# EAGLE design board_0.10v (EAGLE 7.7.0)
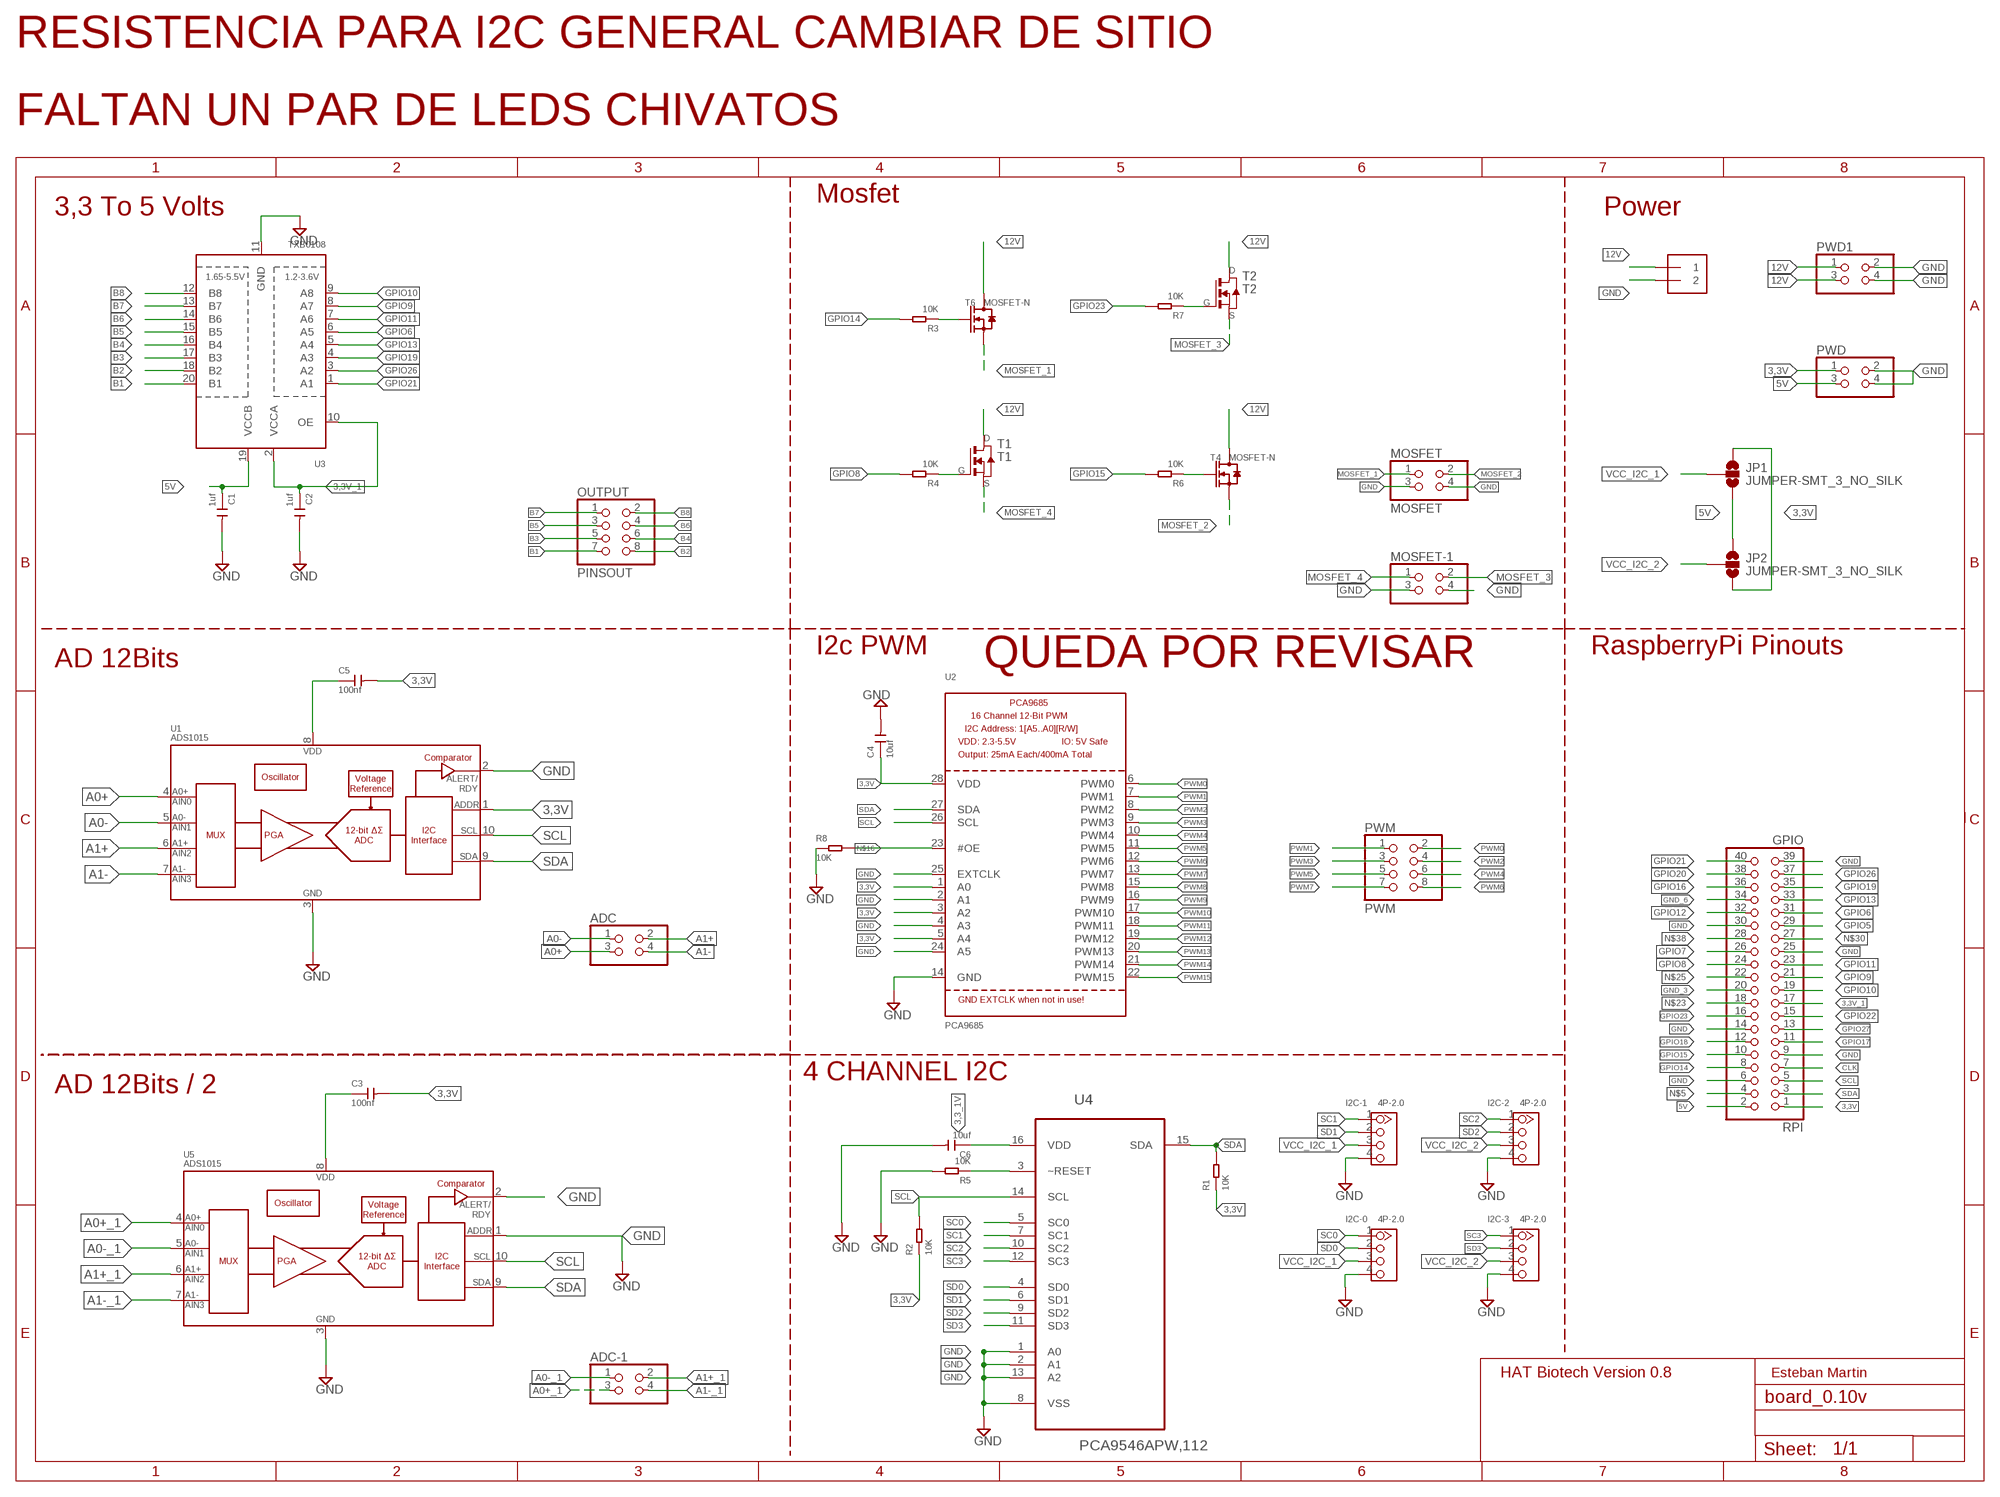
[diagram p0: schematic, sheet 1, part 1 of 2]
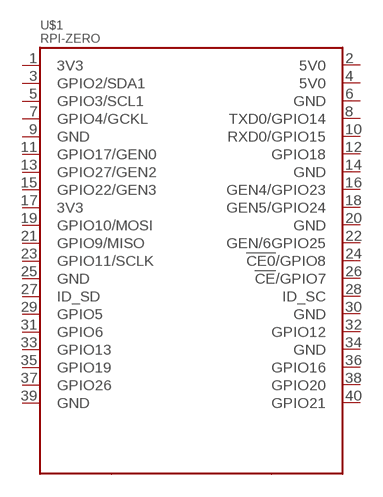
[diagram p1: schematic, sheet 1, part 2 of 2]

## Parts
ADC  PINHD-2X2  [2X02]
ADC-1  PINHD-2X2  [2X02]
C1  1uf  CERAMIC-1UF-25V-10%-X7R(0805)  [C0805]
C2  1uf  CERAMIC-1UF-25V-10%-X7R(0805)  [C0805]
C3  100nf  CERAMIC-100NF-50V-10%-X7R(0805)  [C0805]
C4  10uf  CERAMIC-1UF-25V-10%-X7R(0805)  [C0805]
C5  100nf  CERAMIC-100NF-50V-10%-X7R(0805)  [C0805]
C6  10uf  CERAMIC-1UF-25V-10%-X7R(0805)  [C0805]
I2C-0  4P-2.0  GROVE-CONNECTOR-DIP(4P-2.0)  [HW4-2.0]
I2C-1  4P-2.0  GROVE-CONNECTOR-DIP(4P-2.0)  [HW4-2.0]
I2C-2  4P-2.0  GROVE-CONNECTOR-DIP(4P-2.0)  [HW4-2.0]
I2C-3  4P-2.0  GROVE-CONNECTOR-DIP(4P-2.0)  [HW4-2.0]
INPUT  1X2-3.5MM  [1X2-3.5MM]
JP1  JUMPER-SMT_3_NO_SILK  [SMT-JUMPER_3_NO_SILK]
JP2  JUMPER-SMT_3_NO_SILK  [SMT-JUMPER_3_NO_SILK]
MOSFET  MOSFET  PINHD-2X2  [2X02]
MOSFET-1  PINHD-2X2  [2X02]
OUTPUT  PINSOUT  PINHD-2X4  [2X04]
PWD  PINHD-2X2  [2X02]
PWD1  PINHD-2X2  [2X02]
PWM  PWM  PINHD-2X4  [2X04]
R1  10K  SMD-RES-10K-1%-1/8W(0805)  [R0805]
R2  10K  SMD-RES-10K-1%-1/8W(0805)  [R0805]
R3  10K  SMD-RES-10K-1%-1/8W(0805)  [R0805]
R4  10K  SMD-RES-10K-1%-1/8W(0805)  [R0805]
R5  10K  SMD-RES-10K-1%-1/8W(0805)  [R0805]
R6  10K  SMD-RES-10K-1%-1/8W(0805)  [R0805]
R7  10K  SMD-RES-10K-1%-1/8W(0805)  [R0805]
R8  10K  SMD-RES-10K-1%-1/8W(0805)  [R0805]
RPI  GPIO  PINHD-2X20  [2X20]
T1  T1  NMOSFETTO252  [TO252]
T2  T2  NMOSFETTO252  [TO252]
T4  MOSFET-N  [SOT-23]
T6  MOSFET-N  [SOT-23]
U1  ADS1015  [MSOP10]
U2  PCA9685  [TSSOP28]
U3  TXB0108  TXB0108PWR  [TSSOP20]
U4  PCA9546APW,112  [SOP65P640X110-16N]
U5  ADS1015  [MSOP10]
U$1  RPI-ZERO  [RASPBERRYPI_BASTELSTUBE_V13_RASPI_BOARD_B+_FULL]

## Nets
3,3_1V: C6.1 U4.16(VDD)
3,3V: C3.2 C4.1 C5.2 JP1.1 JP2.3 PWD.1 R1.1 R2.1 RPI.1 U1.1(ADDR) U2.1(A0) U2.3(A2) U2.5(A4) U2.28(VDD)
3,3V_1: C2.1 RPI.17 U3.2(VCCA) U3.10(OE)
5V: C1.1 JP1.3 JP2.1 PWD.3 RPI.2 U3.19(VCCB)
12V: INPUT.1 PWD1.1 PWD1.3 T1.3(D) T2.3(D) T4.3(D) T6.3(D)
A0+: ADC.3 U1.4(AIN0)
A0+_1: ADC-1.3 U5.4(AIN0)
A0-: ADC.1 U1.5(AIN1)
A0-_1: ADC-1.1 U5.5(AIN1)
A1+: ADC.2 U1.6(AIN2)
A1+_1: ADC-1.2 U5.6(AIN2)
A1-: ADC.4 U1.7(AIN3)
A1-_1: ADC-1.4 U5.7(AIN3)
B1: OUTPUT.7 U3.20(B1)
B2: OUTPUT.8 U3.18(B2)
B3: OUTPUT.5 U3.17(B3)
B4: OUTPUT.6 U3.16(B4)
B5: OUTPUT.3 U3.15(B5)
B6: OUTPUT.4 U3.14(B6)
B7: OUTPUT.1 U3.13(B7)
B8: OUTPUT.2 U3.12(B8)
CLK: RPI.7
GND: C1.2 C2.2 C4.2 C6.2 I2C-0.4 I2C-1.4 I2C-2.4 I2C-3.4 INPUT.2 MOSFET-1.3 MOSFET-1.4 MOSFET.3 MOSFET.4 PWD1.2 PWD1.4 PWD.2 PWD.4 R5.2 R8.1 RPI.6 RPI.9 RPI.14 RPI.25 RPI.30 RPI.39 U1.2(ALERT/RDY) U1.3(VSS) U2.2(A1) U2.4(A3) U2.14(GND) U2.24(A5) U2.25(EXTCLK) U3.11(GND) U4.1(A0) U4.2(A1) U4.8(VSS) U4.13(A2) U5.1(ADDR) U5.2(ALERT/RDY) U5.3(VSS)
GND_3: RPI.20
GND_6: RPI.34
GPIO5: RPI.29
GPIO6: RPI.31 U3.6(A5)
GPIO7: RPI.26
GPIO8: R4.2 RPI.24
GPIO9: RPI.21 U3.8(A7)
GPIO10: RPI.19 U3.9(A8)
GPIO11: RPI.23 U3.7(A6)
GPIO12: RPI.32
GPIO13: RPI.33 U3.5(A4)
GPIO14: R3.2 RPI.8
GPIO15: R6.2 RPI.10
GPIO16: RPI.36
GPIO17: RPI.11
GPIO18: RPI.12
GPIO19: RPI.35 U3.4(A3)
GPIO20: RPI.38
GPIO21: RPI.40 U3.1(A1)
GPIO22: RPI.15
GPIO23: R7.2 RPI.16
GPIO26: RPI.37 U3.3(A2)
GPIO27: RPI.13
MOSFET_1: MOSFET.1 T6.2(S)
MOSFET_2: MOSFET.2 T4.2(S)
MOSFET_3: MOSFET-1.2 T2.2(S)
MOSFET_4: MOSFET-1.1 T1.2(S)
N$5: RPI.4
N$6: R3.1 T6.1(G)
N$7: R5.1 U4.3(~RESET)
N$8: C3.1 U5.8(VDD)
N$9: R4.1 T1.1(G)
N$10: R6.1 T4.1(G)
N$11: R7.1 T2.1(G)
N$13: C5.1 U1.8(VDD)
N$16: R8.2 U2.23(#OE)
N$23: RPI.18
N$25: RPI.22
N$30: RPI.27
N$38: RPI.28
PWM0: PWM.2 U2.6(PWM0)
PWM1: PWM.1 U2.7(PWM1)
PWM2: PWM.4 U2.8(PWM2)
PWM3: PWM.3 U2.9(PWM3)
PWM4: PWM.6 U2.10(PWM4)
PWM5: PWM.5 U2.11(PWM5)
PWM6: PWM.8 U2.12(PWM6)
PWM7: PWM.7 U2.13(PWM7)
PWM8: U2.15(PWM8)
PWM9: U2.16(PWM9)
PWM10: U2.17(PWM10)
PWM11: U2.18(PWM11)
PWM12: U2.19(PWM12)
PWM13: U2.20(PWM13)
PWM14: U2.21(PWM14)
PWM15: U2.22(PWM15)
SC0: I2C-0.1 U4.5(SC0)
SC1: I2C-1.1 U4.7(SC1)
SC2: I2C-2.1 U4.10(SC2)
SC3: I2C-3.1 U4.12(SC3)
SCL: R2.2 RPI.5 U1.10(SCL) U2.26(SCL) U4.14(SCL) U5.10(SCL)
SD0: I2C-0.2 U4.4(SD0)
SD1: I2C-1.2 U4.6(SD1)
SD2: I2C-2.2 U4.9(SD2)
SD3: I2C-3.2 U4.11(SD3)
SDA: R1.2 RPI.3 U1.9(SDA) U2.27(SDA) U4.15(SDA) U5.9(SDA)
VCC_I2C_1: I2C-0.3 I2C-1.3 JP1.2
VCC_I2C_2: I2C-2.3 I2C-3.3 JP2.2
Unconnected: U$1.1(3V3) U$1.2(5V0) U$1.3(GPIO2/SDA1) U$1.4(5V0) U$1.5(GPIO3/SCL1) U$1.6(GND) U$1.7(GPIO4/GCKL) U$1.8(TXD0/GPIO14) U$1.9(GND) U$1.10(RXD0/GPIO15) U$1.11(GPIO17/GEN0) U$1.12(GPIO18) U$1.13(GPIO27/GEN2) U$1.14(GND) U$1.15(GPIO22/GEN3) U$1.16(GEN4/GPIO23) U$1.17(3V3) U$1.18(GEN5/GPIO24) U$1.19(GPIO10/MOSI) U$1.20(GND) U$1.21(GPIO9/MISO) U$1.22(GEN/6GPIO25) U$1.23(GPIO11/SCLK) U$1.24(!CE0!/GPIO8) U$1.25(GND) U$1.26(!CE!/GPIO7) U$1.27(ID_SD) U$1.28(ID_SC) U$1.29(GPIO5) U$1.30(GND) U$1.31(GPIO6) U$1.32(GPIO12) U$1.33(GPIO13) U$1.34(GND) U$1.35(GPIO19) U$1.36(GPIO16) U$1.37(GPIO26) U$1.38(GPIO20) U$1.39(GND) U$1.40(GPIO21)

## Notes on the sheet
- RESISTENCIA PARA I2C GENERAL CAMBIAR DE SITIO
- FALTAN UN PAR DE LEDS CHIVATOS
- Mosfet
- 3,3 To 5 Volts | Power
- I2c PWM | RaspberryPi Pinouts
- AD 12Bits | QUEDA POR REVISAR
- 4 CHANNEL I2C
- AD 12Bits / 2
- HAT Biotech Version 0.8 | Esteban Martin

## Library data of the parts
ADC ADC-1 MOSFET MOSFET-1 PWD PWD1 = pinhead:PINHD-2X2: PIN HEADER
C1 C2 = Seeed-OPL-Capacitor:CERAMIC-1UF-25V-10%-X7R(0805): 302010179; MPN: CC0805KKX7R8BB105
C3 C5 = Seeed-OPL-Capacitor:CERAMIC-100NF-50V-10%-X7R(0805): 302010165; MPN: CC0805KRX7R9BB104
C4 C6 = Seeed-OPL-Capacitor:CERAMIC-1UF-25V-10%-X7R(0805): 302010179; MPN: CC0805KKX7R8BB105; VALUE: 1uf
I2C-0 I2C-1-I2C-3 = Seeed-OPL-Connector:GROVE-CONNECTOR-DIP(4P-2.0): 320110033
INPUT = adafruit:1X2: 3.5mm Terminal block http://www.ladyada.net/library/pcb/eaglelibrary.html
JP1 JP2 = SparkFun-Jumpers:JUMPER-SMT_3_NO: Normally open jumper This jumper has three pads in close proximity to each other. Apply solder to close the connection(s).
OUTPUT PWM = adafruit:PINHD-2X4: PIN HEADER
R1-R8 = Seeed-OPL-Resistor:SMD-RES-10K-1%-1/8W(0805): 301010361; MPN: RC0805FR-0710KL
RPI = adafruit:PINHD-2X20: PIN HEADER
T1 T2 = fab_2:NMOSFET: MOS FET
T4 T6 = Seeed-OPL-Transistor:MOSFET-N
U1 U5 = SparkFun-IC-Conversion:ADS1015: ADS1015 12-BIT ADC 12-Bit Del-Sig ADC Four single-ended inputs or two differential inputs Internal PGA I2C interface 2.0-5.5V SparkFun Products SparkFun Block for Intel Edison - ADC <https://www.sparkfun.com/products/13770> (DEV-13770); PROD_ID: IC-12270
U2 = adafruit:PCA9685: PCA9685 - 16 Channel 12-Bit I2C PWM Controller 5.0V tolerant 16 channel, 12-bit I2C PWM controller with 25mA per output (max. 400mA total) Digikey: 568-5931-1-ND
U3 = adafruit:TXB0108PWR: 8-Bit Bi-Directional Level Shifter 1.2V-3.6V (VCCA) to 1.65V-5.5V (VCCB) bi-directional level shifter with auto direction sensing. Max data rate - VCCA 1.8V: 20Mbps (50ns), VCCA 3.3V: 100Mbps (10ns) Digikey: 296-21527-1-ND
U4 = NXP_By_element14_Batch_1:PCA9546APW,112: 4-channel I2C-bus switch with reset; MPN: PCA9546APW,112; OC_FARNELL: 1831208; OC_NEWARK: 70R6610; PACKAGE: TSSOP-16; SUPPLIER: NXP
U$1 = RPI-Zero:RPI-ZERO

## Board
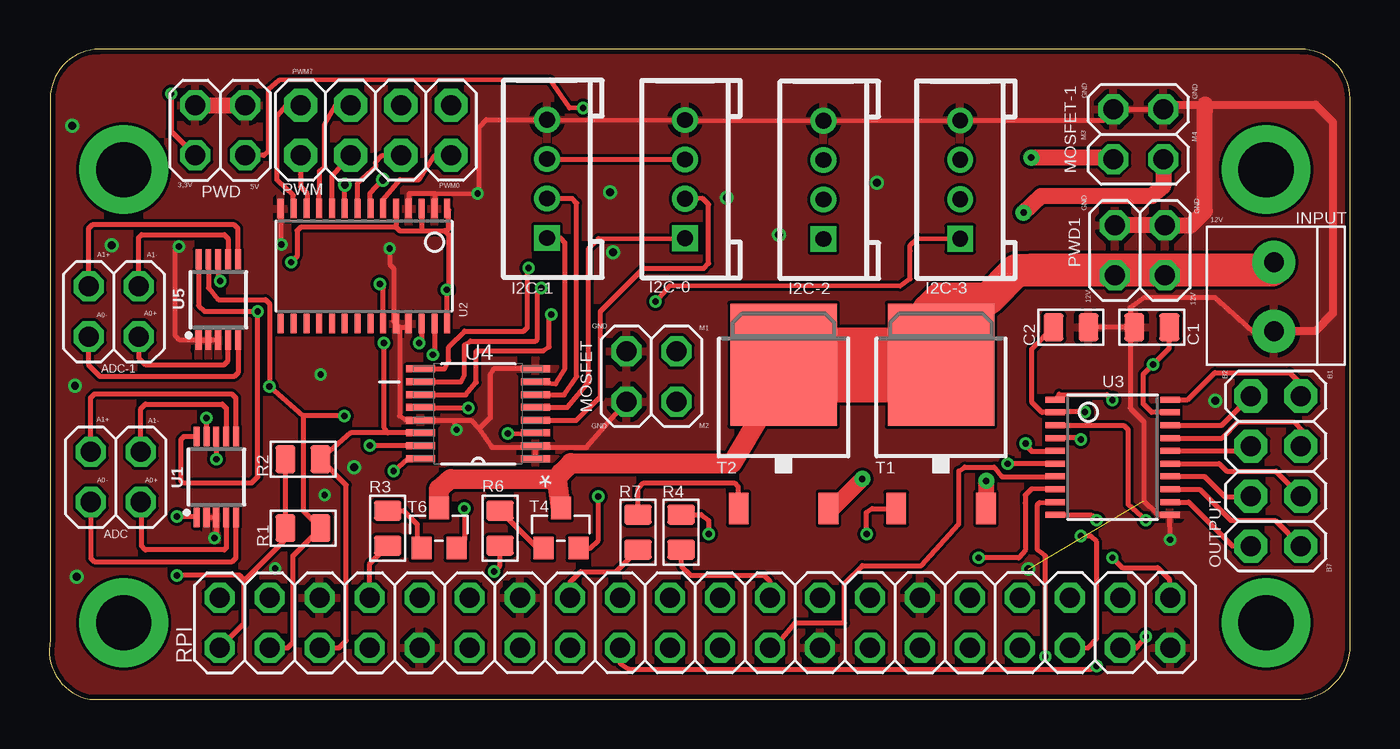
[diagram p2: board, top side]
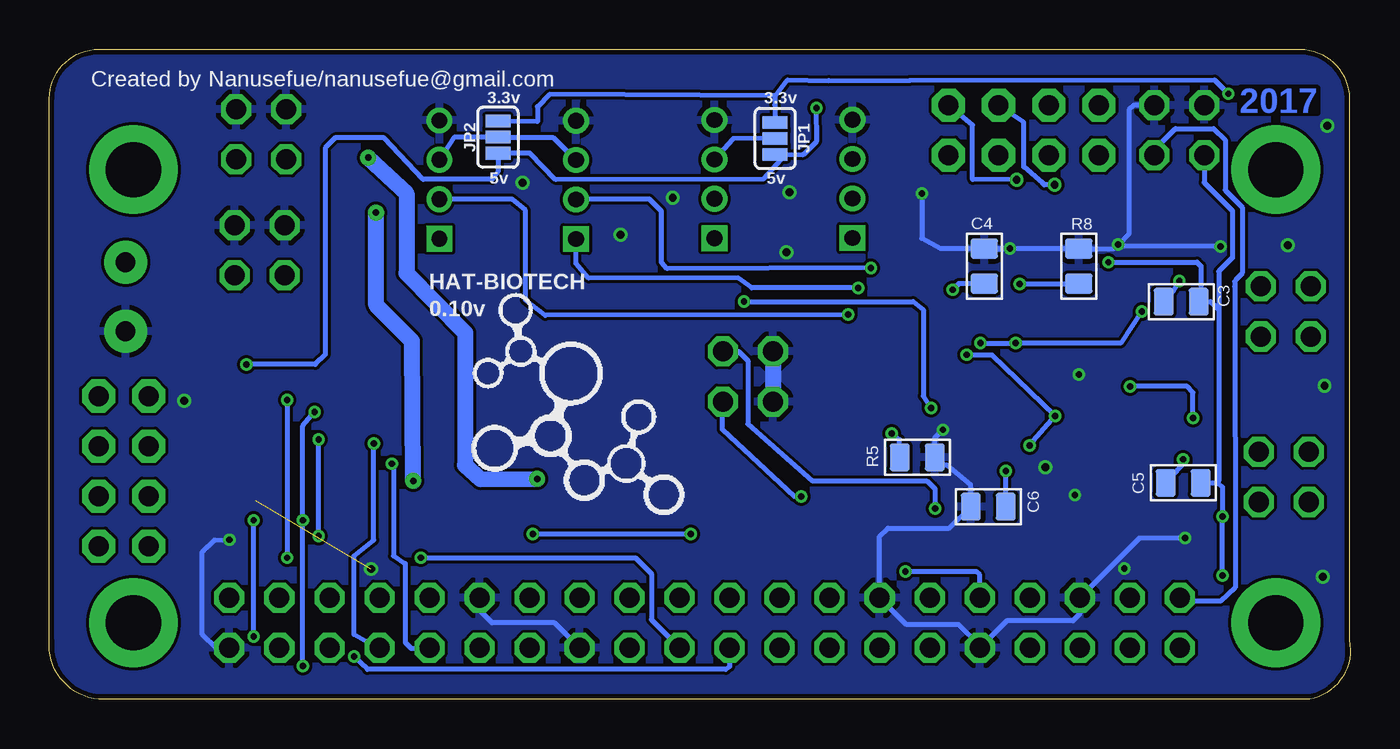
[diagram p3: board, bottom side, seen from below]

Size 66.06 x 33 mm. Coordinates in mm from the lower left corner, seen from the top.
Outline: 0.05,30.5 0.05,3 arc90 2.05,0 63.55,0 arc90 66.05,3 66.05,30.5 arc90 63.55,33 2.55,33 arc90 0.05,30.5
Copper layers (1*16): Top 0.035mm / dielectric 1.5mm / Bottom 0.035mm
Design rules "SeeedStudio_2layer_DRU_no_angle_20140221": minimum track width 6mil, minimum drill 12mil, track to track 6mil, track to pad 6mil, pad to pad 6mil, via to via 6mil, smd to smd 0mil, copper to edge 10mil, drill to drill 10mil, minimum pad ring 10mil, minimum via ring 6mil, stop-mask expansion 2mil, vias tented up to drill 100mil, thermal gap 10mil

### Footprints (pad centres in the part's own frame; a part is rotated, then mirrored left to right if it is on the bottom)
2X02 = drill 1.016 octagon: 1 -1.27,-1.27; 2 -1.27,1.27; 3 1.27,-1.27; 4 1.27,1.27
C0805 = smd 1.397 x 1.016: 1 0,0.889; 2 0,-0.889
HW4-2.0 = drill 0.8 pad 1.27 square: 1 -3,0 | drill 0.8 pad 1.27: 2 -1,0; 3 1,0; 4 3,0
1X2-3.5MM = drill 1 pad 2.184: 1 1.8,0; 2 -1.7,0
SMT-JUMPER_3_NO_SILK = smd 0.635 x 1.27: 1 -0.813,0; 2 0,0; 3 0.813,0
2X04 = drill 1.016 pad 1.676 octagon: 1 -3.81,-1.27; 2 -3.81,1.27; 3 -1.27,-1.27; 4 -1.27,1.27; 5 1.27,-1.27; 6 1.27,1.27; 7 3.81,-1.27; 8 3.81,1.27
R0805 = smd 1.397 x 1.016: 1 0,0.889; 2 0,-0.889
2X20 = drill 1.016 octagon: 1 -24.13,-1.27; 2 -24.13,1.27; 3 -21.59,-1.27; 4 -21.59,1.27; 5 -19.05,-1.27; 6 -19.05,1.27; 7 -16.51,-1.27; 8 -16.51,1.27; 9 -13.97,-1.27; 10 -13.97,1.27; 11 -11.43,-1.27; 12 -11.43,1.27; 13 -8.89,-1.27; 14 -8.89,1.27; 15 -6.35,-1.27; 16 -6.35,1.27; 17 -3.81,-1.27; 18 -3.81,1.27; 19 -1.27,-1.27; 20 -1.27,1.27; 21 1.27,-1.27; 22 1.27,1.27; 23 3.81,-1.27; 24 3.81,1.27; 25 6.35,-1.27; 26 6.35,1.27; 27 8.89,-1.27; 28 8.89,1.27; 29 11.43,-1.27; 30 11.43,1.27; 31 13.97,-1.27; 32 13.97,1.27; 33 16.51,-1.27; 34 16.51,1.27; 35 19.05,-1.27; 36 19.05,1.27; 37 21.59,-1.27; 38 21.59,1.27; 39 24.13,-1.27; 40 24.13,1.27
TO252 = smd 1 x 1.6: 1 -2.28,-4.8; 2 2.28,-4.8 | smd 5.4 x 6.2: 3 0,2.5
SOT-23 = smd 1.016 x 1.143: 1 -0.889,-1.016; 2 0.889,-1.016; 3 0,1.016
MSOP10 = smd 0.3 x 1: 1 -1,-2.05; 2 -0.5,-2.05; 3 0,-2.05; 4 0.5,-2.05; 5 1,-2.05; 6 1,2.05; 7 0.5,2.05; 8 0,2.05; 9 -0.5,2.05; 10 -1,2.05
TSSOP28 = smd 0.305 x 0.991: 1 -4.225,-2.918; 2 -3.575,-2.918; 3 -2.925,-2.918; 4 -2.275,-2.918; 5 -1.625,-2.918; 6 -0.975,-2.918; 7 -0.325,-2.918; 8 0.325,-2.918; 9 0.975,-2.918; 10 1.625,-2.918; 11 2.275,-2.918; 12 2.925,-2.918; 13 3.575,-2.918; 14 4.225,-2.918; 15 4.225,2.918; 16 3.575,2.918; 17 2.925,2.918; 18 2.275,2.918; 19 1.625,2.918; 20 0.975,2.918; 21 0.325,2.918; 22 -0.325,2.918; 23 -0.975,2.918; 24 -1.625,2.918; 25 -2.275,2.918; 26 -2.925,2.918; 27 -3.575,2.918; 28 -4.225,2.918
TSSOP20 = smd 0.305 x 0.991: 1 -2.925,-2.918; 2 -2.275,-2.918; 3 -1.625,-2.918; 4 -0.975,-2.918; 5 -0.325,-2.918; 6 0.325,-2.918; 7 0.975,-2.918; 8 1.625,-2.918; 9 2.275,-2.918; 10 2.925,-2.918; 11 2.925,2.918; 12 2.275,2.918; 13 1.625,2.918; 14 0.975,2.918; 15 0.325,2.918; 16 -0.325,2.918; 17 -0.975,2.918; 18 -1.625,2.918; 19 -2.275,2.918; 20 -2.925,2.918
SOP65P640X110-16N = smd 1.473 x 0.356: 1 -2.921,2.286; 2 -2.921,1.626; 3 -2.921,0.965; 4 -2.921,0.33; 5 -2.921,-0.33; 6 -2.921,-0.965; 7 -2.921,-1.626; 8 -2.921,-2.286; 9 2.921,-2.286; 10 2.921,-1.626; 11 2.921,-0.965; 12 2.921,-0.33; 13 2.921,0.33; 14 2.921,0.965; 15 2.921,1.626; 16 2.921,2.286
RASPBERRYPI_BASTELSTUBE_V13_RASPI_BOARD_B+_FULL = drill 1 pad 1.778 square: 1 8.37,25.23 | drill 1 pad 1.778: 2 8.37,27.77; 3 10.91,25.23; 4 10.91,27.77; 5 13.45,25.23; 6 13.45,27.77; 7 15.99,25.23; 8 15.99,27.77; 9 18.53,25.23; 10 18.53,27.77; 11 21.07,25.23; 12 21.07,27.77; 13 23.61,25.23; 14 23.61,27.77; 15 26.15,25.23; 16 26.15,27.77; 17 28.69,25.23; 18 28.69,27.77; 19 31.23,25.23; 20 31.23,27.77; 21 33.77,25.23; 22 33.77,27.77; 23 36.31,25.23; 24 36.31,27.77; 25 38.85,25.23; 26 38.85,27.77; 27 41.39,25.23; 28 41.39,27.77; 29 43.93,25.23; 30 43.93,27.77; 31 46.47,25.23; 32 46.47,27.77; 33 49.01,25.23; 34 49.01,27.77; 35 51.55,25.23; 36 51.55,27.77; 37 54.09,25.23; 38 54.09,27.77; 39 56.63,25.23; 40 56.63,27.77 | hole 2.75: 3.5,3.5; 3.5,26.5; 61.5,3.5; 61.5,26.5

### Placement (x,y rotation side)
ADC  3.38,11.29 0 top
ADC-1  3.28,19.69 0 top
C1  55.98,18.89 270 top
C2  51.88,18.89 90 top
C3  8.58,20.19 90 bottom
C4  18.58,21.99 180 bottom
C5  8.48,10.99 90 bottom
C6  18.38,9.79 270 bottom
I2C-0  32.29,26.41 90 top
I2C-1  25.27,26.42 90 top
I2C-2  39.31,26.37 90 top
I2C-3  46.25,26.39 90 top
INPUT  62.18,20.39 90 top
JP1  29.21,28.48 270 bottom
JP2  43.28,28.53 90 bottom
MOSFET  30.58,16.39 180 top
MOSFET-1  55.3,28.68 90 top
OUTPUT  62.28,11.59 90 top
PWD  8.68,28.89 0 top
PWD1  55.38,22.79 0 top
PWM  16.58,28.89 180 top
R1  12.88,8.69 90 top
R2  12.88,12.19 90 top
R3  17.18,8.69 0 top
R4  32.08,8.49 0 top
R5  21.98,12.29 90 bottom
R6  22.88,8.69 0 top
R7  29.88,8.49 0 top
R8  13.78,21.99 0 bottom
RPI  32.78,3.89 0 top
T1  45.28,14.49 0 top
T2  37.28,14.49 0 top
T4  25.98,8.69 0 top
T6  19.78,8.69 0 top
U1  8.48,11.29 0 top
U2  15.98,21.99 180 top
U3  53.98,12.29 270 top
U4  21.78,14.49 180 top
U5  8.58,20.29 0 top
U$1  -5.08,-51.85 0 top  (outside the outline)

### Tracks (layer width: path | path; a pad name or v marks a point on that pad's centre or on a via)
3,3_1V  (via drill 0.32)
  Top 0.254: v17.48,11.59 18.2,12.2 U4.16
  Bottom 0.254: C6.1 17.5,11.3 v17.48,11.59
3,3V  (via drill 0.32)
  Top 0.254: R2.1 R1.1 11.88,7.99 9.88,5.99 | 8.62,2.59 RPI.1 9.88,3.85 9.88,5.99 | v6.48,9.29 7.43,9.29 U1.1 | 9.88,5.99 9.88,6.09 9.68,6.29 v6.48,6.29 | U2.5 17.61,23.96 | 17.61,23.96 17.78,23.79 18.98,23.79 | 20.08,23.79 20.18,23.79 20.28,23.89 20.28,24.83 U2.1 | U2.3 18.91,23.86 18.98,23.79 | U2.28 20.18,18.9 v20.18,20.79 20.28,20.89 20.28,23.59 20.08,23.79 | 18.98,23.79 20.08,23.79 | 17.61,23.96 12.76,23.96 12.58,23.79 12.58,22.49 v12.28,22.19 | v6.19,30.75 6.19,28.85 PWD.1
  Bottom 0.254: C5.2 6.78,10.99 | 6.78,10.99 6.48,10.79 v6.48,9.29 v6.48,6.29 | 6.68,19.79 7.08,20.19 C3.2 7.58,20.3 7.58,21.99 7.78,22.19 v12.28,22.19 | 6.68,19.79 6.68,11.09 6.78,10.99 | C4.1 19.87,21.1 v20.18,20.79 | PWD.1 7.41,26.23 5.98,24.8 5.98,22.42 6.27,22.13 6.68,21.72 6.68,19.79 | JP1.1 29.22,30.18 29.2,30.18 29.2,30.65 | 29.2,30.65 28.56,31.44 26.49,31.41 22.37,31.42 6.89,31.45 v6.19,30.75 | 29.2,30.65 40.65,30.7 41.27,30.09 41.27,29.33 JP2.3
3,3V_1  (via drill 0.32)
  Top 0.254: RPI.17 29,1.81 29.42,1.53 52.92,1.53 v53.18,1.69 | v52.58,14.59 51.14,14.59 U3.2 50.41,14.56 49.88,15.09 49.88,17.78 C2.1 50.9,18.99 | U3.10 52.91,9.36 v53.18,9.09
  Bottom 0.254: v53.18,1.69 v53.18,9.09 53.18,13.89 v52.58,14.59
5V  (via drill 0.32)
  Top 0.254: v27.1,30.02 26.42,30.03 25.44,31.44 11.67,31.42 11.12,30.95 11.11,27.79 10.9,27.61 PWD.3 | C1.1 56.87,17.82 v56.05,17 55.55,16.5 55.55,15 55.99,14.56 U3.19
  Bottom 0.254: PWD.3 9.95,27.89 8.87,28.98 6.93,28.98 6.36,28.39 6.36,25.85 5.49,24.98 5.49,21.64 5.81,21.29 5.86,21.22 5.87,20.96 5.84,5.68 6.58,4.99 8.48,4.99 RPI.2 | v27.1,30.02 27.08,28.34 27.74,27.68 27.81,27.65 JP1.3 28.69,27.67 29.82,26.41 40.34,26.39 41.65,27.73 JP2.1 43.28,26.77 43.57,26.4 47.07,26.4 49.05,28.5 51.55,28.5 52.05,28 52.05,17.5 52.55,17 v56.05,17
12V
  Top 0.254: 25.77,11.17 25.98,11.49 | 36.78,15.49 36.48,15.49 36.98,15.59 T2.3 | PWD1.3 61.51,21.52 INPUT.1 | PWD1.1 52.25,21.52 51.98,21.79
  Top 1.016: T6.3 19.78,10.69 20.38,11.19 25.77,11.17 T4.3 | 25.98,11.49 26.48,11.99 34.68,11.99 36.78,15.49
  Top 1.676: INPUT.1 62.08,22.19 62.08,21.79 51.98,21.79 49.89,21.79 49.09,21.76 47.65,20.31 45.21,20.31 44.66,19.76 44.66,16.97 T1.3
  Top 3.81: T2.3 T1.3
A0+
  Top 0.254: U1.4 8.98,7.69 8.88,7.59 4.88,7.59 4.68,7.79 4.68,9.99 ADC.3
A0+_1
  Top 0.254: ADC-1.3 4.55,17.32 4.88,16.99 8.88,16.99 9.08,17.19 U5.4
A0-
  Top 0.254: ADC.1 2.11,7.16 2.28,6.99 9.28,6.99 9.48,7.19 U1.5
A0-_1
  Top 0.254: U5.5 9.58,16.59 9.38,16.39 2.58,16.39 2.01,16.96 ADC-1.1
A1+
  Top 0.254: U1.6 9.48,15.29 9.28,15.49 2.28,15.49 2.08,15.29 2.08,12.59 ADC.2
A1+_1
  Top 0.254: U5.6 9.58,23.89 9.38,24.09 2.18,24.09 1.98,23.89 1.98,20.99 ADC-1.2
A1-
  Top 0.254: ADC.4 4.65,14.76 4.88,14.99 8.78,14.99 8.98,14.79 U1.7
A1-_1
  Top 0.254: ADC-1.4 4.55,23.46 4.68,23.59 8.88,23.59 9.08,23.39 U5.7
B1
  Top 0.254: U3.20 57.81,15.21 59.18,16.59 62.98,16.59 63.58,15.99 63.58,15.43 OUTPUT.7
B2
  Top 0.254: U3.18 59.53,13.91 OUTPUT.8
B3
  Top 0.254: U3.17 59.56,13.26 60.38,14.09 63.18,14.09 63.68,13.59 63.68,12.99 OUTPUT.5
B4
  Top 0.254: U3.16 60.77,12.61 OUTPUT.6
B5
  Top 0.254: U3.15 59.41,11.96 59.78,11.59 62.28,11.59 OUTPUT.3
B6
  Top 0.254: U3.14 58.66,11.31 59.68,10.29 60.98,10.29 OUTPUT.4
B7
  Top 0.254: U3.13 58.41,10.66 59.98,9.09 62.24,9.09 OUTPUT.1
B8
  Top 0.254: U3.12 57.86,10.01 60.09,7.78 OUTPUT.2
GND  (via drill 0.32, 0.4)  (1 unrouted)
  Top 0.254: U4.1 U4.2 24.78,12.79 | C1.2 C2.2 | INPUT.2 61.08,18.69 59.18,20.39 55.58,20.39 54.88,19.89 54.88,18.69 | 54.88,18.69 55.28,18.29 | 20.58,14.16 U4.13 18.93,14.19 18.08,14.19 17.78,14.39 17.78,18.9 | 20.58,14.16 21.41,14.16 21.83,13.74 | 21.83,13.74 22.48,12.79 24.78,12.79 | 54.88,18.69 54.88,14.79 55.58,14.09 55.58,10.09 56.18,9.49 | 56.18,9.49 56.28,9.39 U3.11 v56.91,8.1 | 56.18,9.49 56.28,9.39 56.98,9.39 | 23.98,5.07 RPI.14 | 24.78,12.79 27.28,12.79 MOSFET.4 | v20.68,13.69 20.58,14.16 | U2.4 18.26,24.96 18.28,25.69 19.58,25.69 | 19.58,25.69 v21.75,25.68 21.83,25.69 21.83,29.03 22.19,29.43 I2C-1.4 I2C-0.4 I2C-2.4 I2C-3.4 53.54,29.39 MOSFET-1.4 MOSFET-1.3 56.88,30.19 | U4.8 22.57,16.77 22.38,16.49 22.38,14.29 21.83,13.74 | U2.2 19.56,25.01 19.58,25.69 | 17.78,18.9 U2.24 17.48,19.2 17.48,21.89 17.28,22.09 v17.28,22.89 | 17.78,18.9 18.08,18.9 U2.25 | v11.78,23.09 11.78,24.88 U2.14 | U5.1 U5.2 U5.3 6.63,18.24 6.38,18.49 6.38,22.79 v6.58,22.99 | U1.2 U1.3 8.48,8.29 v8.38,8.19
  Top 0.406: 56.88,30.19 58.68,30.19 64.28,30.19 65.18,29.29 65.18,19.59 64.28,18.69 INPUT.2
  Top 0.813: PWD1.2 PWD1.4 57.95,24.06 58.68,24.79 58.68,29.89 58.68,30.19 | PWD.2 PWD.4
  Bottom 0.254: RPI.39 57.61,2.62 58.28,3.29 58.28,7.49 57.68,8.09 v56.91,8.1 | v20.68,13.69 21.1,13.28 R5.2 20.7,11.89 20.48,11.89 19.27,10.88 C6.2 20.37,8.69 23.48,8.69 23.89,8.28 RPI.14 22.52,3.79 19.88,3.79 18.81,2.72 RPI.9 17.44,3.99 14.08,3.99 13.73,4.34 RPI.6 10.7,8.19 v8.38,8.19 | RPI.25 40.4,3.89 43.58,3.89 44.21,4.52 RPI.30 | C4.2 R8.1 12,22.88 v11.78,23.09 | C4.2 20.77,22.88 21.76,23.4 v21.75,25.68 | v6.58,22.99 11.68,22.99 v11.78,23.09 | C4.2 17.3,22.88 v17.28,22.89 | PWD.4 10.99,30.16 11.24,29.92 11.24,23.64 v11.78,23.09
  Bottom 0.813: MOSFET.3 MOSFET.4
  other vias: 13.78,16.49 15.48,11.79 28.48,25.75 34.4,25.46 42.03,26.22 1.17,29.11 3.18,23.05 1.3,15.91 1.39,6.23 28.62,22.71 59.21,15.16 13.98,10.37 11.47,6.64 37.05,23.58 49.71,6.62
  pour Bottom: 2.47,33.2 64,33.2 arc-91 66.5,30.66 66.12,2.34 arc-89 63.63,-0.12 2.56,-0.47 arc-90 0.04,2.02 -0.03,30.69 arc-90
  pour Top: 2.48,32.99 63.94,33.09 arc-91 66.45,30.55 66.02,2.35 arc-89 63.53,-0.11 2.49,-0.21 arc-90 -0.02,2.29 -0.02,30.49 arc-90
GPIO6  (via drill 0.32)
  Top 0.254: U3.6 v48.66,11.96
  Bottom 0.254: v48.66,11.96 48.58,11.89 48.58,7.29 47.98,6.89 47.98,2.89 47.68,2.59 46.78,2.59 RPI.31
GPIO8
  Top 0.254: R4.2 32.08,6.79 32.58,6.29 36.28,6.29 36.58,5.99 36.58,5.17 RPI.24
GPIO9  (via drill 0.32)
  Top 0.254: U3.8 49.88,10.69 49.56,10.36 49.56,9.96 49.56,7.56 49.23,7.19 v47.18,7.19
  Bottom 0.254: v47.18,7.19 36.28,7.19 35.48,6.38 35.48,4.05 RPI.21
GPIO10  (via drill 0.32)
  Top 0.254: v50.58,2.17 50.58,7.29 50.18,7.59 50.18,9.89 50.28,9.99 U3.9
  Bottom 0.254: v50.58,2.17 49.9,1.52 31.7,1.52 31.51,1.66 RPI.19
GPIO11
  Top 0.254: RPI.23 36.81,2.62 37.88,3.89 40.38,3.89 40.38,5.89 41.28,6.79 44.28,6.79 46.18,8.89 46.18,11.59 46.48,11.79 47.98,11.79 48.38,11.29 51.04,11.29 U3.7
GPIO13  (via drill 0.32)
  Top 0.254: v49.58,12.99 49.58,12.89 49.88,12.59 51.04,12.59 U3.5
  Bottom 0.254: RPI.33 49.41,2.62 50.58,3.29 50.58,7.29 49.58,8.09 v49.58,12.99
GPIO14
  Top 0.254: RPI.8 16.27,6.89 R3.2
GPIO15  (via drill 0.32)
  Top 0.254: v22.58,6.49 22.88,6.79 R6.2
  Bottom 0.254: RPI.10 18.81,6.32 18.98,6.49 v22.58,6.49
GPIO19  (via drill 0.32)
  Top 0.254: RPI.35 52.75,2.62 53.18,3.09 53.18,7.99 52.88,8.29 v52.38,8.29 | v52.38,13.19 52.28,13.29 51.09,13.29 U3.4
  Bottom 0.254: v52.38,8.29 v52.38,13.19
GPIO21  (via drill 0.32)
  Top 0.254: U3.1 51.11,15.21 51.28,15.49 53.71,15.46 v53.98,15.19 | v53.98,7.19 54.48,6.69 56.28,6.69 56.88,6.09 56.88,5.19 RPI.40
  Bottom 0.254: v53.98,15.19 v53.98,7.19
GPIO23
  Top 0.254: RPI.16 26.43,5.94 26.98,6.49 28.77,6.49 R7.2
GPIO26  (via drill 0.32)
  Top 0.254: RPI.37 55.21,2.62 v55.68,3.19 | v55.68,9.09 54.78,9.89 54.78,13.69 54.58,13.89 51.09,13.89 U3.3
  Bottom 0.254: v55.68,3.19 v55.68,9.09
MOSFET_1  (via drill 0.33)
  Top 0.254: v21.08,9.69 21.08,8.08 T6.2
  Bottom 0.254: MOSFET.1 31.05,17.66 30.58,17.19 30.58,13.99 27.3,11.09 21.5,11.09 21.08,10.69 v21.08,9.69
MOSFET_2  (via drill 0.33)
  Top 0.254: T4.2 27.47,7.67 27.88,8.09 v27.88,10.29
  Bottom 0.254: v27.88,10.29 28.23,10.29 31.88,13.69 31.88,14.89 MOSFET.2
MOSFET_3  (via drill 0.33 pad 0.81)
  Top 0.254: 39.76,9.69 T2.2 | 54.08,27.49 54.08,27.46 MOSFET-1.2
  Top 0.813: 54.08,27.49 v49.86,27.5 | v41.28,11.19 39.76,9.69
  Bottom 0.813: v49.86,27.5 47.93,25.68 47.93,21.64 44.94,18.6 44.95,11.89 44.16,11.18 v41.28,11.19
MOSFET_4  (via drill 0.33 pad 0.81)
  Top 0.813: T1.2 v47.58,11.09 | v49.47,24.7 50.37,25.56 55.99,25.56 56.56,26.05 MOSFET-1.1
  Bottom 0.813: v47.58,11.09 47.64,18.19 49.46,20.01 v49.47,24.7
N$1  (via drill 2.8 pad 4.5)
  other vias: 61.78,26.89
N$2  (via drill 2.8 pad 4.5)
  other vias: 3.78,26.89
N$3  (via drill 2.8 pad 4.5)
  other vias: 3.78,3.89
N$4  (via drill 2.8 pad 4.5)
  other vias: 61.78,3.89
N$6
  Top 0.254: R3.1 18,9.58 18.68,8.89 18.68,7.88 T6.1
N$7  (via drill 0.32)
  Top 0.254: v23.28,13.49 U4.3
  Bottom 0.254: R5.1 22.88,13.19 v23.28,13.49
N$8  (via drill 0.32)
  Top 0.254: U5.8 8.58,21.39 v8.68,21.24
  Bottom 0.254: v8.68,21.24 8.99,20.75 C3.1
N$9  (via drill 0.32)
  Top 0.254: R4.1 33.1,9.38 33.48,9.09 v33.48,8.39 | v41.5,8.39 41.48,9.49 41.78,9.69 T1.1
  Bottom 0.254: v33.48,8.39 v41.5,8.39
N$10
  Top 0.254: T4.1 24.79,7.67 R6.1
N$11
  Top 0.254: R7.1 29.88,10.69 30.18,10.99 34.78,10.99 34.98,10.79 34.98,9.71 T2.1
N$13  (via drill 0.32)
  Top 0.254: U1.8 v8.48,12.19
  Bottom 0.254: v8.48,12.19 8.48,11.98 C5.1
N$16  (via drill 0.32)
  Top 0.254: U2.23 16.96,20.91 v16.78,21.09
  Bottom 0.254: v16.78,21.09 13.8,21.09 R8.2
PWM0
  Top 0.254: U2.6 16.95,25.36 17.81,26.38 18.46,26.37 18.77,26.39 19.57,27.61 PWM.2
PWM1  (via drill 0.4)
  Top 0.254: U2.7 16.31,25.21 16.28,25.39 16.28,25.69 v16.94,26.38
  Bottom 0.254: v16.94,26.38 19.18,26.39 19.18,29.15 PWM.1
PWM2
  Top 0.254: U2.8 15.66,26.23 16.59,27.05 16.58,27.27 16.88,27.59 16.91,27.62 PWM.4
PWM3  (via drill 0.4)
  Top 0.254: U2.9 v15.01,26.11
  Bottom 0.254: v15.01,26.11 15.54,26.11 15.62,26.19 16.58,27.04 16.58,29.29 PWM.3
PWM4
  Top 0.254: U2.10 14.36,26.4 14.36,26.56 PWM.6
PWM5
  Top 0.254: U2.11 13.72,26.82 14,27.04 13.98,29.19 14.55,30.16 PWM.5
PWM6
  Top 0.254: PWM.8 12.76,26.63 12.76,26.01 13.08,25.69 U2.12
PWM7
  Top 0.254: U2.13 12.38,25.13 12.4,25.58 11.56,26.36 11.56,29.6 12.05,30.16 PWM.7
SC0
  Top 0.254: U4.5 26.31,14.82 27.38,16.09 27.38,22.89 27.88,23.39 I2C-0.1
SC1
  Top 0.254: U4.7 25.71,16.02 26.18,16.79 26.18,23.19 25.98,23.41 I2C-1.1
SC2  (via drill 0.32 pad 0.3)
  Top 0.254: U4.10 20.91,16.11 21.08,16.49 21.08,17.99 21.38,18.19 24.68,18.19 24.78,18.29 24.78,20.69 v24.98,20.89
  Bottom 0.254: v24.98,20.89 30.38,20.89 31.08,21.39 38.67,21.38 39.32,22.14 I2C-2.1
SC3  (via drill 0.32 pad 0.25, 0.33 pad 0.25)
  Top 0.254: v30.78,20.19 31.48,20.99 43.2,20.98 43.71,21.35 43.7,22.75 43.7,23.05 44.09,23.41 I2C-3.1 | v21.28,14.79 18.99,14.79 U4.12
  Bottom 0.254: v30.78,20.19 22.18,20.19 21.68,19.79 21.68,15.39 v21.28,14.79
SCL  (via drill 0.32, 0.32 pad 0.3)
  Top 0.254: RPI.5 14.71,2.62 15.08,2.99 15.08,10.88 R2.2 15.31,13.52 17.18,13.52 | U4.14 17.18,13.52 | U2.26 18.91,18.21 v18.78,18.09 | v16.98,18.09 16.98,13.82 17.18,13.52 | U5.10 7.58,19.99 7.88,19.69 v10.58,19.69 10.53,19.64 10.58,19.59 10.58,11.29 10.28,10.99 6.78,10.99 6.68,11.09 6.68,13.19 6.83,13.34 U1.10
  Bottom 0.254: v18.78,18.09 v16.98,18.09 11.65,18.09 v10.58,19.69
SD0
  Top 0.254: U4.4 26.75,14.16 27.98,15.39 27.98,19.69 30.18,21.89 33.24,21.88 33.48,22.13 33.48,25.13 33.16,25.43 I2C-0.2
SD1
  Top 0.254: U4.6 26.15,15.46 26.78,16.39 26.78,25.19 26.56,25.41 I2C-1.2
SD2  (via drill 0.32 pad 0.3)
  Top 0.254: U4.9 20.07,16.77 20.28,17.19 20.28,17.89 21.08,18.69 24.08,18.69 24.28,18.89 24.28,21.59 v24.34,21.9
  Bottom 0.254: v24.34,21.9 34.69,21.87 34.98,22.19 34.98,24.79 35.58,25.39 I2C-2.2
SD3  (via drill 0.32 pad 0.3)
  Top 0.254: U4.11 21.15,15.46 21.68,16.09 21.68,17.69 25.08,17.69 25.38,17.89 25.38,19.49 v25.5,19.53
  Bottom 0.254: v25.5,19.53 40.88,19.49 41.89,20.27 41.89,23.91 41.89,24.83 42.57,25.39 I2C-3.2
SDA  (via drill 0.32)
  Top 0.254: U5.9 8.08,20.89 8.58,20.29 10.98,20.29 11.18,20.09 v11.18,15.89 12.88,14.39 | 12.88,14.39 12.88,9.58 R1.2 12.38,7.3 12.38,2.89 12.11,2.62 RPI.3 | U4.15 16.31,12.86 v16.28,12.89 | v14.98,14.39 12.88,14.39 | U1.9 v7.98,14.29 | U2.27 19.56,17.46 v19.48,17.49
  Bottom 0.254: v16.28,12.89 v14.98,14.39 18.18,17.49 v19.48,17.49 | v7.98,14.29 7.98,15.59 8.28,15.89 v11.18,15.89
VCC_I2C_1
  Top 0.254: I2C-1.3 I2C-0.3
  Bottom 0.254: JP1.2 31.34,28.46 I2C-0.3
VCC_I2C_2
  Bottom 0.254: I2C-2.3 40.48,28.52 JP2.2 45.49,28.52 I2C-3.3

### Text on the board
Bottom: 2017
bPlace: 3.3v | 3.3v | Created by Nanusefue/nanusefue@gmail.com | 5v | 5v | HAT-BIOTECH / 0.10v
tNames: PWM7 | GND | GND | M3 | M4 | 3,3V | 5V | PWM0 | GND | GND | 12V | A1+ | A1- | A0- | A0+ | 12V | 12V | GND | M1 | B2 | B1 | A1+ | A1- | GND | M2 | A0- | A0+ | B7